# Altium schematic sheet Oscilloscope_V02.SchDoc
size A2; SheetNumber: 1; SheetTotal: 1
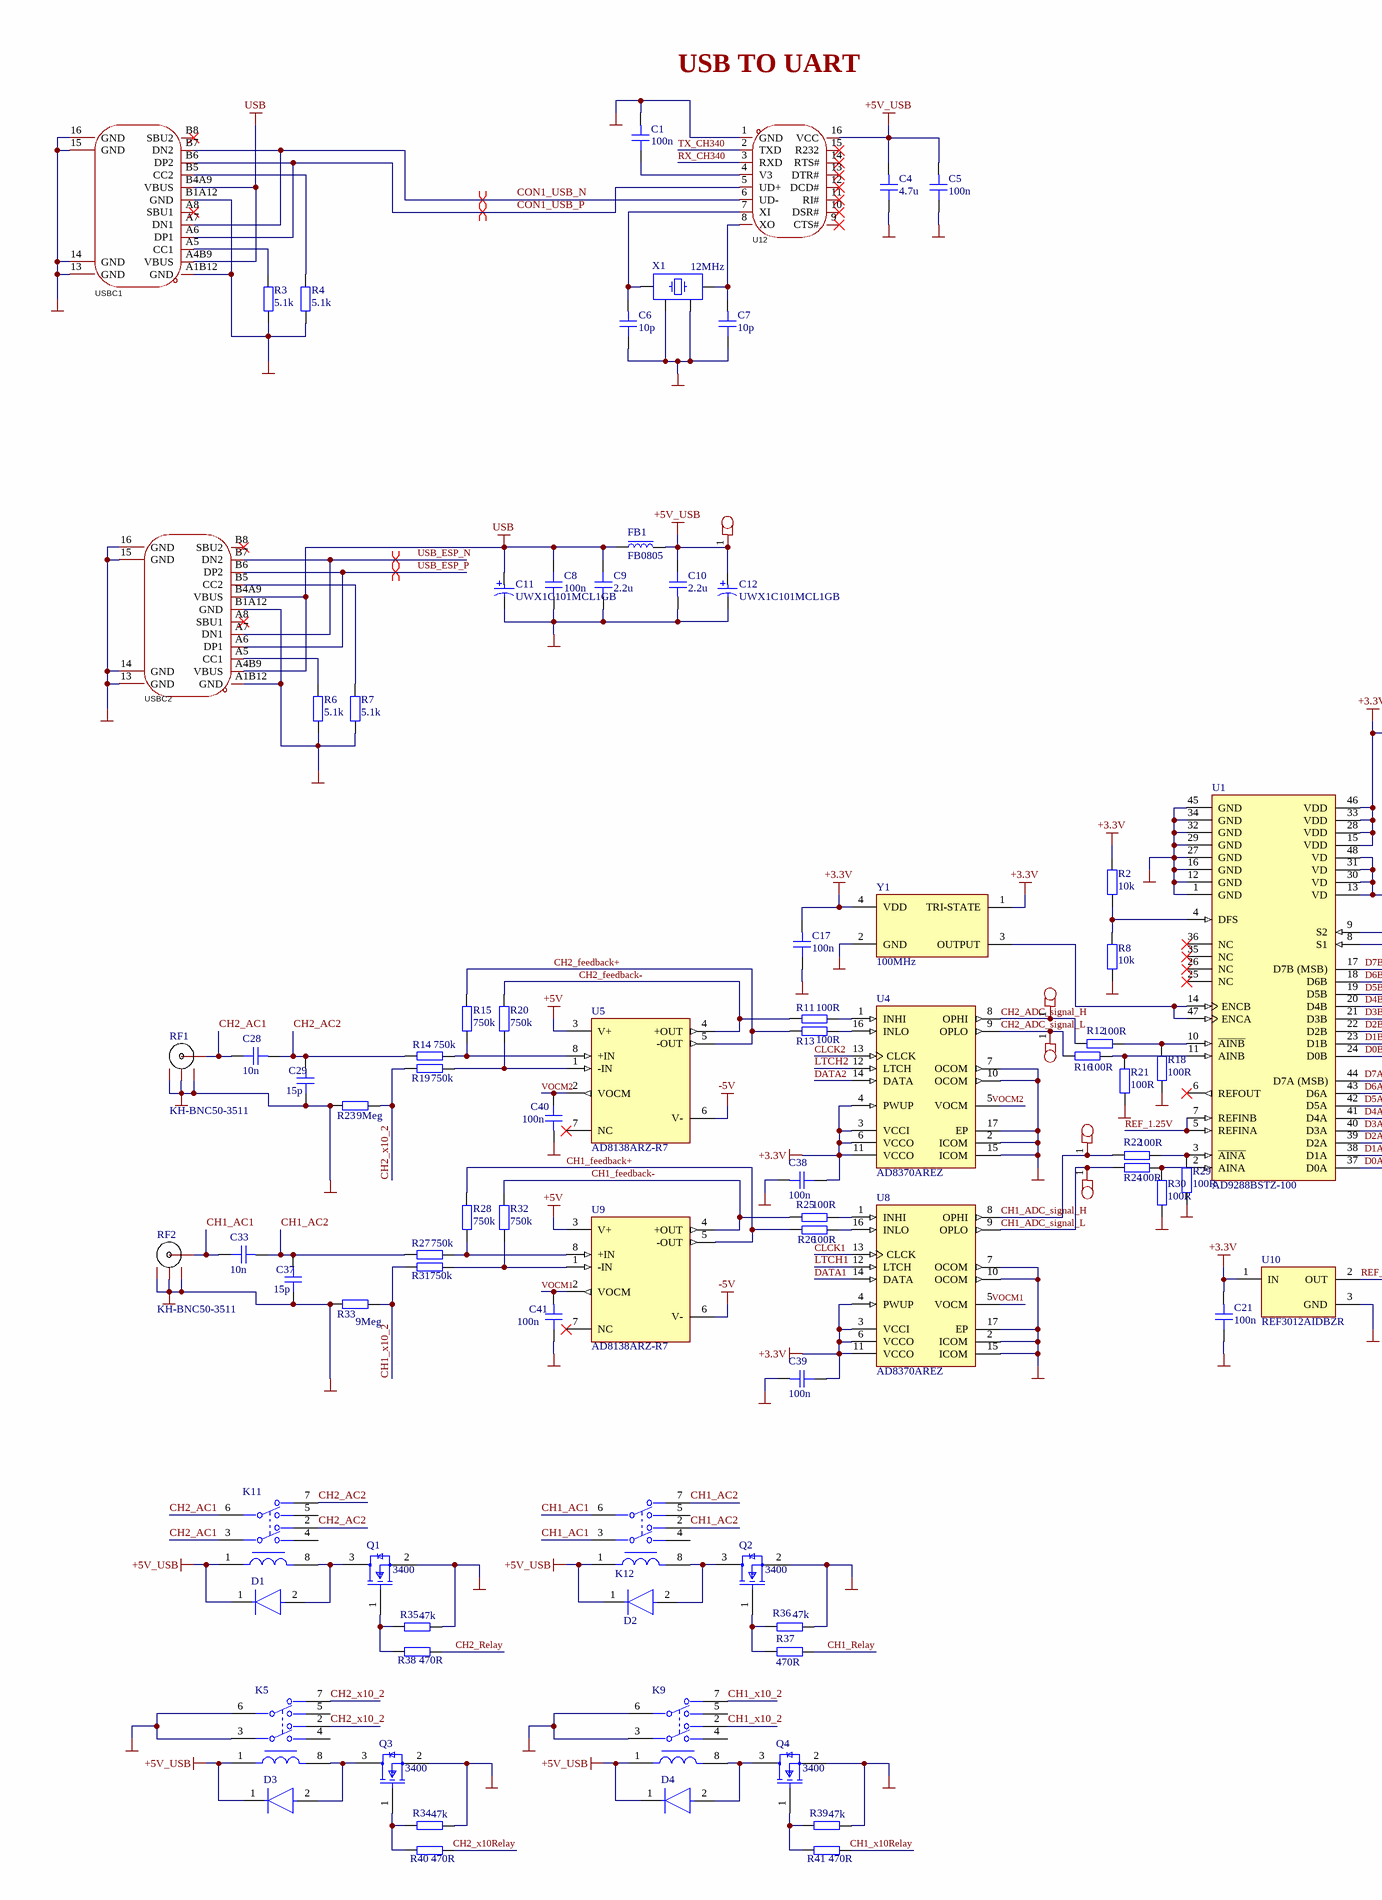
[diagram p0: Oscilloscope_V02.SchDoc, left]
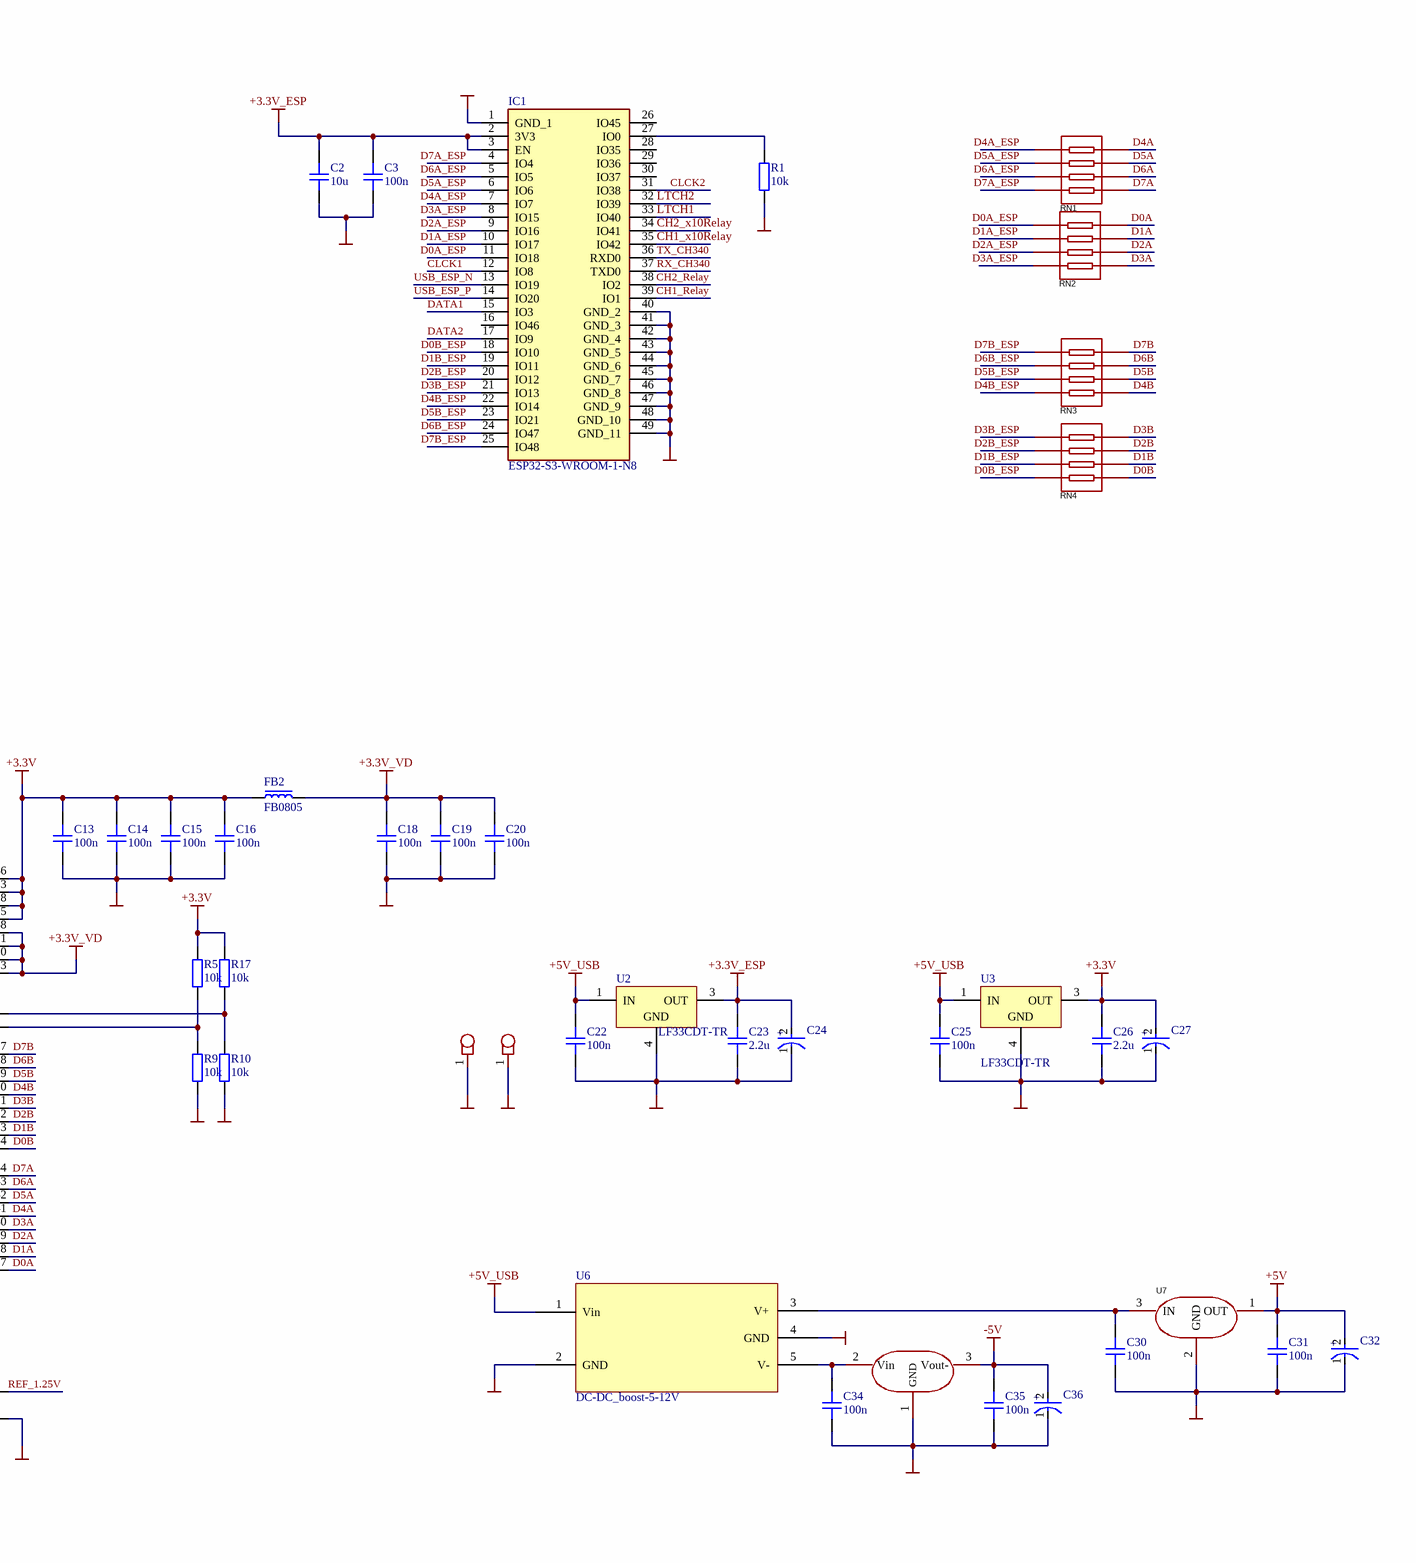
[diagram p1: Oscilloscope_V02.SchDoc, right]

## Parts
C1  100n  [CAP_0603]
C2  10u  [CAP_0603]
C3  100n  [CAP_0603]
C4  4.7u  [CAP_0603]
C5  100n  [CAP_0603]
C6  10p  [CAP_0603]
C7  10p  [CAP_0603]
C8  100n  [CAP_0603]
C9  2.2u  [CAP_0603]
C10  2.2u  [CAP_0603]
C11  UWX1C101MCL1GB  [CAPAE7067X55L]
C12  UWX1C101MCL1GB  [CAPAE7067X55L]
C13  100n  [CAP_0603]
C14  100n  [CAP_0603]
C15  100n  [CAP_0603]
C16  100n  [CAP_0603]
C17  100n  [CAP_0603]
C18  100n  [CAP_0603]
C19  100n  [CAP_0603]
C20  100n  [CAP_0603]
C21  100n  [CAP_0603]
C22  100n  [CAP_0603]
C23  2.2u  [CAP_0603]
C24  UWX1C100MCL2GB  [FP-UWX1C100MCL2GB-MFG]  (value not drawn)
C25  100n  [CAP_0603]
C26  2.2u  [CAP_0603]
C27  UWX1C100MCL2GB  [FP-UWX1C100MCL2GB-MFG]  (value not drawn)
C28  10n  [CAP_0603]
C29  15p  [CAP_0603]
C30  100n  [CAP_0603]
C31  100n  [CAP_0603]
C32  UWX1C100MCL2GB  [FP-UWX1C100MCL2GB-MFG]  (value not drawn)
C33  10n  [CAP_0603]
C34  100n  [CAP_0603]
C35  100n  [CAP_0603]
C36  UWX1C100MCL2GB  [FP-UWX1C100MCL2GB-MFG]  (value not drawn)
C37  15p  [CAP_0603]
C38  100n  [CAP_0603]
C39  100n  [CAP_0603]
C40  100n  [CAP_0603]
C41  100n  [CAP_0603]
D1  RRE02VTM4SFHTR  [FP-TUMD2SM-MFG]  (value not drawn)
D2  RRE02VTM4SFHTR  [FP-TUMD2SM-MFG]  (value not drawn)
D3  RRE02VTM4SFHTR  [FP-TUMD2SM-MFG]  (value not drawn)
D4  RRE02VTM4SFHTR  [FP-TUMD2SM-MFG]  (value not drawn)
FB1  FB0805  [FB_0805]
FB2  FB0805  [FB_0805]
IC1  ESP32-S3-WROOM-1-N8  [ESP32S3WROOM1N8R2]
K1  5001_C238122  [TEST-TH_BD2.54-P1.39]  (value not drawn)
K2  5001_C238122  [TEST-TH_BD2.54-P1.39]  (value not drawn)
K3  5001_C238122  [TEST-TH_BD2.54-P1.39]  (value not drawn)
K4  5001_C238122  [TEST-TH_BD2.54-P1.39]  (value not drawn)
K5  G6K-2F-Y-TR-DC5  [FP-G6K-2F-Y-TR-DC5-MFG]  (value not drawn)
K6  5001_C238122  [TEST-TH_BD2.54-P1.39]  (value not drawn)
K7  5001_C238122  [TEST-TH_BD2.54-P1.39]  (value not drawn)
K8  5001_C238122  [TEST-TH_BD2.54-P1.39]  (value not drawn)
K9  G6K-2F-Y-TR-DC5  [FP-G6K-2F-Y-TR-DC5-MFG]  (value not drawn)
K11  G6K-2F-Y-TR-DC5  [FP-G6K-2F-Y-TR-DC5-MFG]  (value not drawn)
K12  G6K-2F-Y-TR-DC5  [FP-G6K-2F-Y-TR-DC5-MFG]  (value not drawn)
Q1  3400  [FP-318-08-IPC_B]
Q2  3400  [FP-318-08-IPC_B]
Q3  3400  [FP-318-08-IPC_B]
Q4  3400  [FP-318-08-IPC_B]
R1  10k  [RES_0603]
R2  10k  [RES_0603]
R3  5.1k  [RES_0603]
R4  5.1k  [RES_0603]
R5  10k  [RES_0603]
R6  5.1k  [RES_0603]
R7  5.1k  [RES_0603]
R8  10k  [RES_0603]
R9  10k  [RES_0603]
R10  10k  [RES_0603]
R11  100R  [RES_0603]
R12  100R  [RES_0603]
R13  100R  [RES_0603]
R14  750k  [RES_0603]
R15  750k  [RES_0603]
R16  100R  [RES_0603]
R17  10k  [RES_0603]
R18  100R  [RES_0603]
R19  750k  [RES_0603]
R20  750k  [RES_0603]
R21  100R  [RES_0603]
R22  100R  [RES_0603]
R23  9Meg  [RES_0603]
R24  100R  [RES_0603]
R25  100R  [RES_0603]
R26  100R  [RES_0603]
R27  750k  [RES_0603]
R28  750k  [RES_0603]
R29  100R  [RES_0603]
R30  100R  [RES_0603]
R31  750k  [RES_0603]
R32  750k  [RES_0603]
R33  9Meg  [RES_0603]
R34  47k  [RES_0603]
R35  47k  [RES_0603]
R36  47k  [RES_0603]
R37  470R  [RES_0603]
R38  470R  [RES_0603]
R39  47k  [RES_0603]
R40  470R  [RES_0603]
R41  470R  [RES_0603]
RF1  KH-BNC50-3511  [ANT-TH_KH-BNC50-3511]
RF2  KH-BNC50-3511  [ANT-TH_KH-BNC50-3511]
RN1  4D03WGJ0221T5E  [RES-ARRAY-SMD_0603-8P-L3.2-W1.6-BL]  (value not drawn)
RN2  4D03WGJ0221T5E  [RES-ARRAY-SMD_0603-8P-L3.2-W1.6-BL]  (value not drawn)
RN3  4D03WGJ0221T5E  [RES-ARRAY-SMD_0603-8P-L3.2-W1.6-BL]  (value not drawn)
RN4  4D03WGJ0221T5E  [RES-ARRAY-SMD_0603-8P-L3.2-W1.6-BL]  (value not drawn)
U1  AD9288BSTZ-100  [ST-48_M]
U2  LF33CDT-TR  [TO-252_N]
U3  LF33CDT-TR  [TO-252_N]
U4  AD8370AREZ  [ADI-RE-16-2_M]
U5  AD8138ARZ-R7  [FP-R-8-IPC_A]
U6  DC-DC_boost-5-12V  [Dip]
U7  78L05_C112446  [SOT-89-3_L4.5-W2.5-P1.50-LS4.2-BR]  (value not drawn)
U8  AD8370AREZ  [ADI-RE-16-2_M]
U9  AD8138ARZ-R7  [FP-R-8-IPC_A]
U10  REF3012AIDBZR  [DBZ0003A_M]
U11  79L05_C122849  [SOT-89-3_L4.5-W2.5-P1.50-LS4.2-BR]  (value not drawn)
U12  CH340G  [SOIC-16_L9.9-W3.9-P1.27-LS6.0-BL]  (value not drawn)
USBC1  TYPEC-304YSSW-ACP16  [USB-SMD_TYPEC-304YSSW-ACP16]  (value not drawn)
USBC2  TYPEC-304YSSW-ACP16  [USB-SMD_TYPEC-304YSSW-ACP16]  (value not drawn)
X1  12MHz  [XTAL_2520]
Y1  100MHz  [OT2EL89CJI-111YLC]

## Nets
+3.3V: C13.1 C14.1 C15.1 C16.1 C17.1 C21.1 C26.1 C27.2(A) C38.2 C39.2 FB2.1 R2.2 R5.2 R17.2 U1.15(VDD) U1.28(VDD) U1.33(VDD) U1.46(VDD) U3.3(OUT) U4.3(VCCI) U4.4(PWUP) U4.6(VCCO) U4.11(VCCO) U8.3(VCCI) U8.4(PWUP) U8.6(VCCO) U8.11(VCCO) U10.1(IN) Y1.1(TRI-STATE) Y1.4(VDD)
+3.3V_ESP: C2.1 C3.1 C23.1 C24.2(A) IC1.2(3V3) IC1.3(EN) U2.3(OUT)
+3.3V_VD: C18.1 C19.1 C20.1 FB2.2 U1.13(VD) U1.30(VD) U1.31(VD) U1.48(VD)
+5V: C31.1 C32.2(A) U5.3(V+) U7.1(OUT) U9.3(V+)
+5V_USB: C4.1 C5.1 C10.2 C12.1 C22.1 C25.1 D1.1(C) D2.1(C) D3.1(C) D4.1(C) FB1.2 K1.1 K5.1 K9.1 K11.1 K12.1 U2.1(IN) U3.1(IN) U6.1(Vin) U12.16(VCC)
-5V: C35.1 C36.2(A) U5.6(V-) U9.6(V-) U11.3(Vout-)
GND: C1.1 C2.2 C3.2 C4.2 C5.2 C6.2 C7.2 C8.1 C9.1 C10.1 C11.2 C12.2 C13.2 C14.2 C15.2 C16.2 C17.2 C18.2 C19.2 C20.2 C21.2 C22.2 C23.2 C24.1(C) C25.2 C26.2 C27.1(C) C29.2 C30.2 C31.2 C32.1(C) C34.2 C35.2 C36.1(C) C37.2 C38.1 C39.1 C40.1 C41.2 IC1.1(GND_1) IC1.40(GND_2) IC1.41(GND_3) IC1.42(GND_4) IC1.43(GND_5) IC1.44(GND_6) IC1.45(GND_7) IC1.46(GND_8) IC1.47(GND_9) IC1.48(GND_10) IC1.49(GND_11) K2.1 K4.1 K5.3 K5.6 K9.3 K9.6 Q1.2(S) Q2.2(S) Q3.2(S) Q4.2(S) R1.1 R3.2 R4.2 R6.2 R7.2 R8.1 R9.1 R10.1 R18.1 R21.1 R23.2 R29.1 R30.1 R33.2 R34.2 R35.2 R36.2 R39.2 RF1.2 RF1.3 RF1.4 RF2.2 RF2.3 RF2.4 U1.1(GND) U1.12(GND) U1.16(GND) U1.27(GND) U1.29(GND) U1.32(GND) U1.34(GND) U1.45(GND) U2.4(GND) U3.4(GND) U4.2(ICOM) U4.7(OCOM) U4.10(OCOM) U4.15(ICOM) U4.17(EP) U6.2(GND) U6.4(GND) U7.2(GND) U8.2(ICOM) U8.7(OCOM) U8.10(OCOM) U8.15(ICOM) U8.17(EP) U10.3(GND) U11.1(GND) U12.1(GND) USBC1.13(GND) USBC1.14(GND) USBC1.15(GND) USBC1.16(GND) USBC1.A1B12(GND) USBC1.B1A12(GND) USBC2.13(GND) USBC2.14(GND) USBC2.15(GND) USBC2.16(GND) USBC2.A1B12(GND) USBC2.B1A12(GND) X1.2 X1.4 Y1.2(GND)
USB: C8.2 C9.2 C11.1 FB1.1 USBC1.A4B9(VBUS) USBC1.B4A9(VBUS) USBC2.A4B9(VBUS) USBC2.B4A9(VBUS)
CH1_AC1: C33.2 K12.3 K12.6 RF2.1(OUT)
CH1_AC2: C33.1 C37.1 K12.2 K12.7 R27.2
CH1_ADC_signal_H: K7.1 R22.1 U8.8(OPHI)
CH1_ADC_signal_L: K8.1 R24.1 U8.9(OPLO)
CH1_feedback+: R26.1 R28.1 U9.5(-OUT)
CH1_feedback-: R25.1 R32.1 U9.4(+OUT)
CH1_Relay: IC1.39(IO1) R37.1
CH1_x10_2: K9.2 K9.7 R31.2 R33.1
CH1_x10Relay: IC1.35(IO42) R41.1
CH2_AC1: C28.2 K11.3 K11.6 RF1.1(OUT)
CH2_AC2: C28.1 C29.1 K11.2 K11.7 R14.2
CH2_ADC_signal_H: K3.1 R12.1 U4.8(OPHI)
CH2_ADC_signal_L: K6.1 R16.1 U4.9(OPLO)
CH2_feedback+: R13.1 R15.1 U5.5(-OUT)
CH2_feedback-: R11.1 R20.1 U5.4(+OUT)
CH2_Relay: IC1.38(IO2) R38.1
CH2_x10_2: K5.2 K5.7 R19.2 R23.1
CH2_x10Relay: IC1.34(IO41) R40.1
CLCK1: IC1.12(IO8) U8.13(CLCK)
CLCK2: IC1.31(IO38) U4.13(CLCK)
CON1_USB_N: U12.6(UD-) USBC1.A7(DN1) USBC1.B7(DN2)
CON1_USB_P: U12.5(UD+) USBC1.A6(DP1) USBC1.B6(DP2)
D0A: RN2.8 U1.37(D0A)
D0A_ESP: IC1.11(IO18) RN2.1
D0B: RN4.5 U1.24(D0B)
D0B_ESP: IC1.18(IO10) RN4.4
D1A: RN2.7 U1.38(D1A)
D1A_ESP: IC1.10(IO17) RN2.2
D1B: RN4.6 U1.23(D1B)
D1B_ESP: IC1.19(IO11) RN4.3
D2A: RN2.6 U1.39(D2A)
D2A_ESP: IC1.9(IO16) RN2.3
D2B: RN4.7 U1.22(D2B)
D2B_ESP: IC1.20(IO12) RN4.2
D3A: RN2.5 U1.40(D3A)
D3A_ESP: IC1.8(IO15) RN2.4
D3B: RN4.8 U1.21(D3B)
D3B_ESP: IC1.21(IO13) RN4.1
D4A: RN1.8 U1.41(D4A)
D4A_ESP: IC1.7(IO7) RN1.1
D4B: RN3.5 U1.20(D4B)
D4B_ESP: IC1.22(IO14) RN3.4
D5A: RN1.7 U1.42(D5A)
D5A_ESP: IC1.6(IO6) RN1.2
D5B: RN3.6 U1.19(D5B)
D5B_ESP: IC1.23(IO21) RN3.3
D6A: RN1.6 U1.43(D6A)
D6A_ESP: IC1.5(IO5) RN1.3
D6B: RN3.7 U1.18(D6B)
D6B_ESP: IC1.24(IO47) RN3.2
D7A: RN1.5 U1.44(D7A_(MSB))
D7A_ESP: IC1.4(IO4) RN1.4
D7B: RN3.8 U1.17(D7B_(MSB))
D7B_ESP: IC1.25(IO48) RN3.1
DATA1: IC1.15(IO3) U8.14(DATA)
DATA2: IC1.17(IO9) U4.14(DATA)
LTCH1: IC1.33(IO40) U8.12(LTCH)
LTCH2: IC1.32(IO39) U4.12(LTCH)
REF_1.25V: U1.5(REFINA) U1.7(REFINB) U10.2(OUT)
RX_CH340: IC1.37(TXD0) U12.3(RXD)
TX_CH340: IC1.36(RXD0) U12.2(TXD)
USB_ESP_N: IC1.13(IO19) USBC2.A7(DN1) USBC2.B7(DN2)
USB_ESP_P: IC1.14(IO20) USBC2.A6(DP1) USBC2.B6(DP2)
VOCM1: C41.1 U8.5(VOCM) U9.2(VOCM)
VOCM2: C40.2 U4.5(VOCM) U5.2(VOCM)
NetC1_2: C1.2 U12.4(V3)
NetC6_1: C6.1 U12.7(XI) X1.1
NetC7_1: C7.1 U12.8(XO) X1.3
NetC30_1: C30.1 U6.3(V+) U7.3(IN)
NetC34_1: C34.1 U6.5(V-) U11.2(Vin)
NetD1_2: D1.2(A) K11.8 Q1.3(D)
NetD2_2: D2.2(A) K12.8 Q2.3(D)
NetD3_2: D3.2(A) K5.8 Q3.3(D)
NetD4_2: D4.2(A) K9.8 Q4.3(D)
NetIC1_27: IC1.27(IO0) R1.2
NetQ1_1: Q1.1(G) R35.1 R38.2
NetQ2_1: Q2.1(G) R36.1 R37.2
NetQ3_1: Q3.1(G) R34.1 R40.2
NetQ4_1: Q4.1(G) R39.1 R41.2
NetR2_1: R2.1 R8.2 U1.4(DFS)
NetR3_1: R3.1 USBC1.A5(CC1)
NetR4_1: R4.1 USBC1.B5(CC2)
NetR5_1: R5.1 R9.2 U1.8(S1)
NetR6_1: R6.1 USBC2.A5(CC1)
NetR7_1: R7.1 USBC2.B5(CC2)
NetR10_2: R10.2 R17.1 U1.9(S2)
NetR11_2: R11.2 U4.1(INHI)
NetR12_2: R12.2 R18.2 U1.10(~{AINB})
NetR13_2: R13.2 U4.16(INLO)
NetR14_1: R14.1 R15.2 U5.8(+IN)
NetR16_2: R16.2 R21.2 U1.11(AINB)
NetR19_1: R19.1 R20.2 U5.1(-IN)
NetR22_2: R22.2 R29.2 U1.3(~{AINA})
NetR24_2: R24.2 R30.2 U1.2(AINA)
NetR25_2: R25.2 U8.1(INHI)
NetR26_2: R26.2 U8.16(INLO)
NetR27_1: R27.1 R28.2 U9.8(+IN)
NetR31_1: R31.1 R32.2 U9.1(-IN)
NetU1_14: U1.14(ENCB) U1.47(ENCA) Y1.3(OUTPUT)

Not connected (* = marked no-connect by the designer): IC1 16(IO46) 26(IO45) 28(IO35) 29(IO36) 30(IO37); K5 4 5; K9 4 5; K11 4 5; K12 4 5; U1 6(REFOUT)* 25(NC)* 26(NC)* 35(NC)* 36(NC)*; U5 7(NC)*; U9 7(NC)*; U12 9(CTS#)* 10(DSR#)* 11(RI#)* 12(DCD#)* 13(DTR#)* 14(RTS#)* 15(R232)*; USBC1 A8(SBU1)* B8(SBU2)*; USBC2 A8(SBU1)* B8(SBU2)*

## Layout directives
differential pair: CON1_USB_N, CON1_USB_P, USB_ESP_N, USB_ESP_P

## Notes on the sheet
- USB TO UART
- (in symbol CMP-00267-00203106-1) +

## Library data of the parts
C1-C10 C13-C23 C25 C26 C28-C31 C33-C35 C37-C41 = CMP-001-00085-1: Capacitor SMD 0603; Source: Schematic-Lib-PhilsLab.SchLib; Distributor Link: *; Dielectric: *; Manufacturer: *; Rating: *; Manufacturer Part Number: *; Design Item ID: CAP_0603; LCSC: *
C11 C12 = CMP-2000-07374-1: Aluminum Electrolytic Capacitor, 100 uF, +/- 20%, 16 V, -40 to 85 degC, 2-Pin SMD, RoHS, Tape and Reel; Manufacturer: Nichicon; Type: Can; Rated Voltage: 16V; Capacitance: 100µF; Case Size/Dimension: Ø6.3x5.4mm; Mounting Technology: SurfaceMount; Datasheet Version: 08/2015; Operating Temp-Max: 85°C; Datasheet URL: http://nichicon-us.com/english/products/pdfs/e-uwx.pdf; Package Description: 2-Pin Surface Mount Device, Body 6.6 x 6.6 mm; Package Reference: CAPAE7067X55; Manufacturer URL: http://www.nichicon.co.jp/english/
C24 C27 C32 C36 = CMP-00267-00203106-1: UWX1C100MCL2GB WX Series 10 uF 16 V 85°C Ø3 x 5.4 mm SMT Chip Aluminum Electrolytic Cap; NexarPartId: 203106; Leakage Current: 3µA; Capacitance: 10µF; Voltage Rating: 16V; Life (Hours): 2000hours; Dielectric Material: Aluminium; Tolerance: 20%; Dissipation Factor: 19%; Ripple Current (AC): 18mA; Lead Diameter: 800µm; Height - Seated (Max): 2.9972mm; Lead Free: Lead Free; Length: 5.4mm; Mount: Surface Mount; Min Operating Temperature: -40°C; Schedule B: 8532220020, 8532220020; Width: 3.3mm; Voltage: 16V; Features: General Purpose; Ripple Current: 18mA; Lead Pitch: 800µm; RoHS: Compliant; Voltage Rating (AC): 16V; Max Operating Temperature: 85°C; Height: 5.4mm; Case/Package: SMD/SMT; Radiation Hardening: No; REACH SVHC: No SVHC; Voltage Rating (DC): 16V; Diameter: 3mm; Termination: SMD/SMT; Packaging: Cut Tape; Number of Pins: 2
D1-D4 = CMP-00574-71466012-1: RRE02VTM4SFHTR Rectifier Diode 400V 0.2A Automotive AEC-Q101 2-Pin TUMD-SM T/R; Max Forward Surge Current (Ifsm): 1A; Forward Voltage: 1.1V; Forward Current: 200mA; Element Configuration: Single; Mount: Surface Mount; RoHS: Non-Compliant; Lifecycle Status: Production; NexarPartId: 71466012; Max Operating Temperature: 150°C; Number of Terminals: 2; Packaging: Cut Tape; REACH SVHC: Unknown; Number of Pins: 2; Max Repetitive Reverse Voltage (Vrrm): 400V
FB1 FB2 = FB_0805: Ferrite Bead SMD 0805; Manufacturer: *; Manufacturer Part Number: *; Distributor Link: *; LCSC: *
IC1 = ESP32-S3-WROOM-1-N8: Integrated Circuit; Manufacturer_Name: Espressif Systems; Datasheet Link: https://www.espressif.com/sites/default/files/documentation/esp32-s3-wroom-1_wroom-1u_datasheet_en.pdf; Height: 3.25mm; Manufacturer_Part_Number: ESP32-S3-WROOM-1-N8; Mouser Part Number: 356-ESP32-S3WROOM1N8; Mouser Price/Stock: https://www.mouser.co.uk/ProductDetail/Espressif-Systems/ESP32-S3-WROOM-1-N8?qs=Wj%2FVkw3K%252BMC1mq0KGPvoSQ%3D%3D
K1-K4 K6-K8 = 5001_C238122: Manufacturer: Keystone; Symbol: 5001; Add into BOM: yes; Device: 5001_C238122; LCSC Part Name: 5001; Supplier Part: C238122; Manufacturer Part: 5001; Supplier Footprint: -; JLCPCB Part Class: Extended Part; Datasheet: https://atta.szlcsc.com/upload/public/pdf/source/20211115/64B944F8418AA2CF0680BB1B201435FB.pdf; Supplier: LCSC; Convert to PCB: yes
K5 K9 K11 K12 = CMP-08823-000003-1: RELAY TELECOM DPDT 1A 5VDC; Manufacturer: Omron; Coil Current: 21.1mA; Coil Type: Non-Latching; Number Of Contacts: 2; Coil Voltage: 5V; Coil Power: 100mW; Standoff Height: 0.3mm; Coil Resistance: 237Ω; Current Rating: 2A; Digikey Description: RELAY TELECOM DPDT 1A 5VDC; Manufacturer Part Number: G6K-2F-Y-TR-DC5; Height: 5.4mm; Temperature Range Low: -40°C; Throw Configuration: DPDT; Package: G6K-2F-Y-TR-DC5; Device Class L1: Electromechanical; Device Class L2: Relays; Mouser Description: Electromechanical Relay DPDT 1A 5VDC 237Ohm Surface Mount; ComponentLink2URL: https://omronfs.omron.com/en_US/ecb/products/pdf/en-g6k.pdf; Lead Free: Yes; Device Class L3: Signal Relays; Temperature: -40°C to +70°C; Category: Relay; RoHS: TRUE; Ambient Temperature Range Low: -40°C; Temperature Range High: +70°C; Octopart: https://octopart.com/g6k-2f-y-tr-dc5-omron-697853; Ambient Temperature Range High: +70°C; Automotive: No; ComponentLink2Description: Datasheet; Switching Current: 1A
Q1-Q4 = CMP-07173-000101-1: MOSFET N-CH 50V 220MA SOT-23; Turn-Off Delay Time: 20ns; Element Configuration: Single; Rds On Max: 3.5R; Gate to Source Voltage (Vgs): 20V; Threshold Voltage: 1.3V; Number of Elements: 1; Power Dissipation: 360mW; Rise Time: 9ns; Turn-On Delay Time: 2.5ns; Input Capacitance: 27pF; On-State Resistance: 6R; Lead Free: Lead Free; Length: 2.92mm; Width: 1.3mm; Drain to Source Breakdown Voltage: 50V; Min Operating Temperature: -55°C; REACH SVHC: No SVHC; Packaging: Tape and Reel; Radiation Hardening: No; Height: 0.93mm; Drain to Source Voltage (Vdss): 50V; Current Rating: 220mA; Voltage Rating (DC): 50V; Weight: 0.03g; Continuous Drain Current (ID): 220mA; Number of Pins: 3; Nominal Vgs: 1.3V; Max Power Dissipation: 360mW; Fall Time: 9ns; Drain to Source Resistance: 3.5R; Contact Plating: Tin; Case/Package: SOT-23; Package Quantity: 1; Dual Supply Voltage: 50V; Mount: Surface Mount; Termination: SMD/SMT; Max Operating Temperature: 150°C
R1-R41 = RES_0603: Resistor SMD 0603; Manufacturer: *; Manufacturer Part Number: *; Distributor Link: *; LCSC: *
RN1-RN4 = 4D03WGJ0221T5E: Manufacturer: UNI-ROYAL(厚声); Add into BOM: yes; Value: 220Ω; Tolerance: ±5%; Temperature Coefficient: ±200ppm/℃; Symbol: 4D03WGJ0221T5E; Device: 4D03WGJ0221T5E; LCSC Part Name: 220Ω ±5% 0603x4; Supplier Part: C29719; Manufacturer Part: 4D03WGJ0221T5E; Supplier Footprint: 0603x4; JLCPCB Part Class: Extended Part; Datasheet: https://atta.szlcsc.com/upload/public/pdf/source/20191224/C474318_2527498AE30E813171187CCD28401A71.pdf; Supplier: LCSC; Convert to PCB: yes
U1 = CMP-0313-02377-2: Dual 8-Bit Analog-to-Digital Converter with Parallel Interface, 100MSPS, -40 to +85 degC, ST-48, Pb-Free, Tray; Generic Part Number: AD9288-100; Manufacturer: Analog Devices; Channels: 2; Throughput Rate (SPS): 100M; Interface: Par; Resolution (Bits): 8; PartNumber: AD9288BSTZ-100; Mounting Technology: Surface Mount; ComponentLink4Description: Product URL; ComponentLink1URL: http://www.analog.com/en/index.html; ComponentLink4URL: http://www.analog.com/en/analog-to-digital-converters/ad-converters/ad9288/products/product.html; ComponentLink2Description: Datasheet; ComponentLink3URL: http://www.analog.com/static/imported-files/packages/PKG_PDF/LQFP%28ST%29/ST_48.pdf; PackageDescription: 48-Pin Thin Quad Flat Pack 0.5 mm Pitch; Packing: Tray; PackageVersion: revA; ComponentLink3Description: Package Specification; ComponentLink1Description: Manufacturer URL; DatasheetVersion: Rev.C; PackageReference: ST-48; ComponentLink2URL: http://www.analog.com/static/imported-files/data_sheets/AD9288.pdf; RoHS: Y
U2 U3 = CMP-0244-00069-1: 500mA, Very Low Drop (0.45V) Voltage Regulator, 3.3V, 3-Pin DPAK, Tape and Reel; ComponentLink1URL: http://www.st.com; PackageDescription: 3-Pin Transistor Outline Package 2.28 mm Pitch, 9.7 mm Lead Span (DPAK); ComponentLink2Description: Datasheet; ComponentLink1Description: Manufacturer URL; PackageReference: TO-252; DatasheetVersion: 1/11/2010; ComponentLink2URL: http://www.st.com/internet/com/TECHNICAL_RESOURCES/TECHNICAL_LITERATURE/DATASHEET/CD00000546.pdf; PackageVersion: 2011
U4 U8 = CMP-0291-00034-1: LF to 750 MHz, Digitally Controlled VGA, 34dB, 5.5V, 78mA, RE-16-2, Pb-Free, 96 Tube; Spectral Noise: 2.1(nV/rtHz); Noise Figure: 7.4dB; Distortion (3rd): 62dBc; Distortion (2nd): 65dBc; Output IP3: 31dBm; -3 dB BW: 750MHz; ComponentLink3URL: http://www.analog.com/static/imported-files/packages/PKG_PDF/TSSOP_EP(RE)/RE_16_2.pdf; Gain: 34dB; Code_JEDEC: MO-153-ABT; DatasheetVersion: Rev. B; PackageDescription: 16-Lead Thin Shrink Small Outline With Exposed Pad [TSSOP_EP]; ComponentLink2URL: http://www.analog.com/static/imported-files/data_sheets/AD8370.pdf; PackageVersion: 050806-A; ComponentLink2Description: Datasheet; PackageReference: RE-16-2; ComponentLink3Description: Package Specification; Supply Voltage (V): 5.5V; ComponentLink1URL: www.analog.com; ComponentLink1Description: Manufacturer URL
U5 U9 = CMP-09081-000074-1: IC ADC DRIVER 8SOIC; Input Offset Voltage (Vos): 1mV; Voltage Gain: 0.028dB; Operating Supply Current: 20mA; Number of Channels: 1; Max Power Dissipation: 550mW; Input Bias Current: 7uA; Input Resistance: 6MR; -3db Bandwidth: 320MHz; Slew Rate: 1150V/µs; Min Supply Voltage: 2.7V; Operating Supply Voltage: 9V; Max Supply Voltage: 11V; Min Dual Supply Voltage: 1.4V; Common Mode Rejection Ratio: 70dB; Max Dual Supply Voltage: 5.5V; Lead Free: Contains Lead; Radiation Hardening: No; Mount: Surface Mount; Nominal Supply Current: 20mA; Package Quantity: 1000; Case/Package: SOIC; Series: -; Min Operating Temperature: -40°C; Packaging: Tape and Reel; Bandwidth: 320MHz; Number of Elements: 1; Power Dissipation: 550mW; Number of Pins: 8; RoHS Compliant: Yes; Gain Bandwidth Product: 320MHz; Number of Circuits: 1; Power Supply Rejection Ratio (PSRR): 70dB; Supply Current: 20mA; Max Operating Temperature: 85°C
U7 = 78L05_C112446: Manufacturer: SHIKUES(时科); Symbol: 78L05; Add into BOM: yes; Maximum Input Voltage: 35V; Output Voltage: 5V; MAX Output Current: 150mA; Power Supply Rejection Ratio (PSRR): 49dB@(120Hz); Dropout Voltage: 1.7V@(40mA); Output Polarity: Positive electrode; Number of Outputs: 1; Device: 78L05_C112446; LCSC Part Name: 输入35V 输出5V 150mA; Supplier Part: C112446; Manufacturer Part: 78L05; Supplier Footprint: SOT-89-3; JLCPCB Part Class: Extended Part; Datasheet: https://atta.szlcsc.com/upload/public/pdf/source/20170721/C122848_1500622633164834592.pdf; Supplier: LCSC; Convert to PCB: yes
U10 = CMP-0367-00192-2: 1.25 V, 50 ppm / degC, 50 uA Series (Bandgap) Voltage Reference, -40 to 125 degC, 3-pin SOT-23 (DBZ), Green (RoHS & no Sb/Br); Manufacturer: Texas Instruments; VI(Min)(V): 1.8; Iq(Max)(uA): 50; Rating: Catalog; Temp Coeff(Typ)(ppm/ degree C): 20; VI(Max)(V): 5.5; SubFamily: Series Voltage Reference; VO(V): 1.25; Initial Accuracy @ 25/deg C(%): 0.2; Mounting Technology: Surface Mount; PackageDescription: 3-Pin Plastic Small Outline, Body 2.92 x 1.3 mm, Pitch 0.95 mm; PartNumber: REF3012AIDBZR; ComponentLink3Description: Package Specification; Temp Coeff(Max)(ppm/ degree C): 50; ComponentLink1URL: http://www.ti.com/; PackageVersion: 4203227/B; ComponentLink3URL: http://www.ti.com/litv/pdf/mpds108a; ComponentLink2URL: http://www.ti.com/general/docs/lit/getliterature.tsp?genericPartNumber=REF3012&fileType=pdf; Eco-Plan: Green (RoHS & no Sb/Br); ComponentLink2Description: Datasheet; Code_JEDEC: TO-236; ComponentLink1Description: Manufacturer URL; PackageReference: DBZ0003A; DatasheetVersion: SBVS032F
U11 = 79L05_C122849: Manufacturer: SHIKUES(时科); Symbol: 79L05; Add into BOM: yes; Maximum Input Voltage: 35V; Output Voltage: 5V; MAX Output Current: 150mA; Power Supply Rejection Ratio (PSRR): 49dB@(120Hz); Dropout Voltage: 1.7V@(40mA); Output Polarity: Negative electrode; Number of Outputs: 1; Device: 79L05_C122849; LCSC Part Name: 输入35V 输出5V 150mA; Supplier Part: C122849; Manufacturer Part: 79L05; Supplier Footprint: SOT-89-3; JLCPCB Part Class: Extended Part; Datasheet: https://atta.szlcsc.com/upload/public/pdf/source/20180625/C122890_584C137742CBBDB4CE2BEC6B637E5E74.pdf; Supplier: LCSC; Convert to PCB: yes
U12 = CH340G: Manufacturer: WCH(南京沁恒); Add into BOM: yes; Applications Function: Transceiver; Supply Voltage: 3.3V；5V; Data Rate: 2Mbps; Symbol: CH340G; Device: CH340G; LCSC Part Name: USB转串口芯片 CH340; Supplier Part: C14267; Manufacturer Part: CH340G; Supplier Footprint: SOP-16; JLCPCB Part Class: Extended Part; Datasheet: https://atta.szlcsc.com/upload/public/pdf/source/20230530/6E401E9554E9F5311886CC8B3F89B62E.pdf; Supplier: LCSC; Convert to PCB: yes
USBC1 USBC2 = TYPEC-304YSSW-ACP16: Manufacturer: XUNPU(讯普); Add into BOM: yes; Connector Type: Type-C; Gender: Female; Number of Ports: 1; Number of Contacts: 16P; Current Rating - Power (Max): 5A; Soldering Temperature(Max): 260℃; Symbol: TYPEC-304YSSW-ACP16; Device: TYPEC-304YSSW-ACP16; LCSC Part Name: Type-C 母 卧贴; Supplier Part: C2840392; Manufacturer Part: TYPEC-304YSSW-ACP16; Supplier Footprint: SMD; JLCPCB Part Class: Extended Part; Datasheet: https://atta.szlcsc.com/upload/public/pdf/source/20210615/C2840392_E4D6700BD82FA37F52F4054C59437243.pdf; Supplier: LCSC; Convert to PCB: yes; Standard: USB 3.1; Mounting Style: 卧贴; Contact Material: -; Contact Plating: -; Operating Temperature Range: -25℃~+85℃
X1 = XTAL_2520: Crystal SMD 2520; Distributor Link: *
Y1 = OT2EL89CJI-111YLC: MP: ASEDV-12.000MHZ-LC; Value: *; Package: None; Price: None; Availability: Unavailable